# EAGLE schematic amp_soha_v2 (EAGLE 6.4)
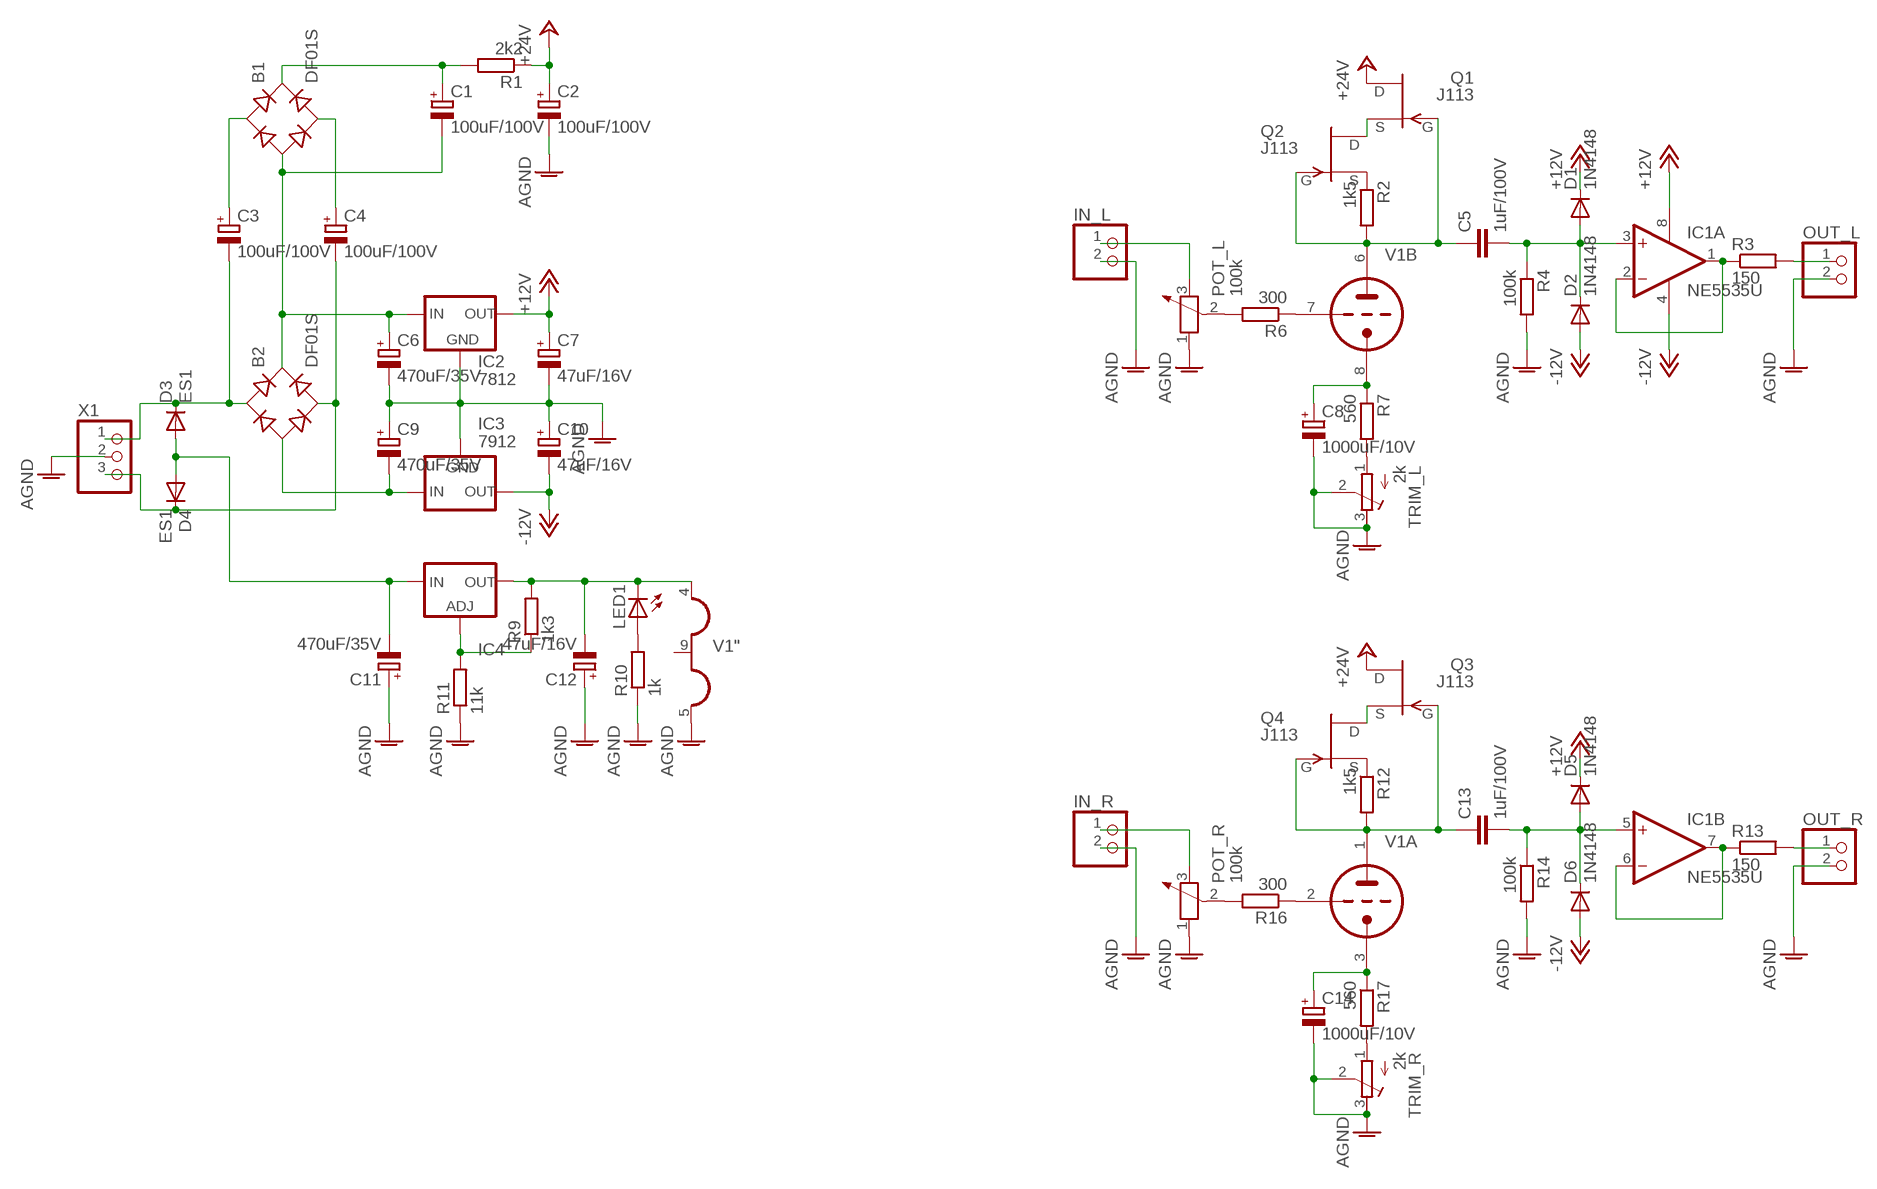
[diagram p0: schematic, sheet 1]

## Parts
B1  DF01S  [DFS]
B2  DF01S  [DFS]
C1  100uF/100V  CPOL-EUE5-10,5  [E5-10,5]
C2  100uF/100V  CPOL-EUE5-10,5  [E5-10,5]
C3  100uF/100V  CPOL-EUE5-10,5  [E5-10,5]
C4  100uF/100V  CPOL-EUE5-10,5  [E5-10,5]
C5  1uF/100V  C-EU075-052X106  [C075-052X106]
C6  470uF/35V  CPOL-EUE5-10,5  [E5-10,5]
C7  47uF/16V  CPOL-EUE2.5-6  [E2,5-6]
C8  1000uF/10V  CPOL-EUE5-10,5  [E5-10,5]
C9  470uF/35V  CPOL-EUE5-10,5  [E5-10,5]
C10  47uF/16V  CPOL-EUE2.5-6  [E2,5-6]
C11  470uF/35V  CPOL-EUE5-10,5  [E5-10,5]
C12  47uF/16V  CPOL-EUE2.5-6  [E2,5-6]
C13  1uF/100V  C-EU075-052X106  [C075-052X106]
C14  1000uF/10V  CPOL-EUE5-10,5  [E5-10,5]
D1  1N4148  [D0805]
D2  1N4148  [D0805]
D3  ES1  [DO-214AC]
D4  ES1  [DO-214AC]
D5  1N4148  [D0805]
D6  1N4148  [D0805]
IC1  NE5535U  [SO08]
IC2  7812  78XXTO-220  [78XXS]
IC3  7912  79XXTO-220  [79XXS]
IC4  LM337TS  [337TS]
IN_L  PINHD-1X2  [1X02]
IN_R  PINHD-1X2  [1X02]
LED1  LED5MM  [LED5MM]
OUT_L  PINHD-1X2  [1X02]
OUT_R  PINHD-1X2  [1X02]
POT_L  100k  POTENTIOMETER_  [1X03]
POT_R  100k  POTENTIOMETER_  [1X03]
Q1  J113  [TO92]
Q2  J113  [TO92]
Q3  J113  [TO92]
Q4  J113  [TO92]
R1  2k2  R-EU_  [R0805]
R2  1k5  R-EU_  [R0805]
R3  150  R-EU_  [R0805]
R4  100k  R-EU_  [R0805]
R6  300  R-EU_  [R0805]
R7  560  R-EU_  [R0805]
R9  1k3  R-EU_  [R0805]
R10  1k  R-EU_  [R0805]
R11  11k  R-EU_  [R0805]
R12  1k5  R-EU_  [R0805]
R13  150  R-EU_  [R0805]
R14  100k  R-EU_  [R0805]
R16  300  R-EU_  [R0805]
R17  560  R-EU_  [R0805]
TRIM_L  2k  RTRIM329W  [RTRIM3296W]
TRIM_R  2k  RTRIM329W  [RTRIM3296W]
V1  12AU7-P  [NOVAL]
X1  W237-103  [W237-103]

## Nets
+12V: C7.+ D1.K(C) D5.K(C) IC1.8(A:V+) IC2.OUT
+24V: C2.+ Q1.3(D) Q3.3(D) R1.1
-12.6V: C12.- IC4.3(OUT) LED1.K(C) R9.2 V1.4(":H1)
-12V: C10.- D2.A D6.A IC1.4(A:V-) IC3.OUT
AGND: C2.- C6.- C7.- C8.- C9.+ C10.+ C11.+ C12.+ C14.- IC2.GND IC3.GND IN_L.2 IN_R.2 OUT_L.2 OUT_R.2 POT_L.1 POT_R.1 R4.2 R10.1 R11.1 R14.2 TRIM_L.2(S) TRIM_L.3(E) TRIM_R.2(S) TRIM_R.3(E) V1.5(":H3) X1.2
N$1: B2.AC1 C3.- D3.C X1.1
N$2: B2.AC2 C4.- D4.C X1.3
N$3: C11.- D3.A D4.A IC4.2(IN)
N$4: IC4.1(ADJ) R9.1 R11.2
N$5: B2.- C9.- IC3.IN
N$6: B1.- B2.+ C1.- C6.+ IC2.IN
N$7: LED1.A R10.2
N$8: B1.AC1 C3.+
N$9: B1.AC2 C4.+
N$10: R16.1 V1.2(A:TG)
N$11: B1.+ C1.+ R1.2
N$12: IN_L.1 POT_L.3
N$13: POT_L.2 R6.2
N$14: R6.1 V1.7(B:TG)
N$15: C8.+ R7.1 V1.8(B:TK)
N$16: Q2.2(S) R2.1
N$17: R7.2 TRIM_L.1(A)
N$18: R17.2 TRIM_R.1(A)
N$19: C5.1 Q1.1(G) Q2.1(G) R2.2 V1.6(B:TA)
N$20: Q1.2(S) Q2.3(D)
N$22: C5.2 D1.A D2.K(C) IC1.3(A:+IN) R4.1
N$24: IC1.1(A:OUT) IC1.2(A:-IN) R3.1
N$25: OUT_L.1 R3.2
N$26: IN_R.1 POT_R.3
N$27: POT_R.2 R16.2
N$29: C14.+ R17.1 V1.3(A:TK)
N$31: C13.1 Q3.1(G) Q4.1(G) R12.2 V1.1(A:TA)
N$32: Q4.2(S) R12.1
N$33: Q3.2(S) Q4.3(D)
N$34: C13.2 D5.A D6.K(C) IC1.5(B:+IN) R14.1
N$35: IC1.6(B:-IN) IC1.7(B:OUT) R13.1
N$36: OUT_R.1 R13.2
Unconnected: V1.9(":H2)

## Library data of the parts
B1 B2 = amp_soha:DF*S: Surface Mount Glass Passivated Bridge Rectifiers Source: Source: Comchip Bridge Rectifiers DF005S-G thru DF10S-G.pdf
C1-C4 C6-C12 C14 = amp_soha:CPOL-EU: POLARIZED CAPACITOR, European symbol
C5 C13 = amp_soha:C-EU: CAPACITOR, European symbol
D1 D2 D5 D6 = amp_soha:1N4148: DIODE general purpose rectifier, 1 A
D3 D4 = amp_soha:ES1
IC1 = amp_soha:NE5535: Dual Operational Amplifier Low Power, Single-Supply, Rail-To-Rail Operational Amplifier Source: http://focus.ti.com/lit/ds/symlink/opa2345.pdf http://focus.ti.com .. opa241.pdf http://focus.ti.com/lit/ds/symlink/opa2134.pdf
IC2 = amp_soha:78XX: VOLTAGE REGULATOR
IC3 = amp_soha:79XX: VOLTAGE REGULATOR
IC4 = amp_soha:LM337TS: VOLTAGE REGULATOR
IN_L IN_R OUT_L OUT_R = amp_soha:PINHD-1X2: PIN HEADER
LED1 = amp_soha:LED
POT_L POT_R = amp_soha:POTENTIOMETER_: Potentiometer
Q1-Q4 = amp_soha:J113: N-Channel Junction FET
R1-R4 R6 R7 R9-R14 R16 R17 = amp_soha:R-EU_: RESISTOR, European symbol
TRIM_L TRIM_R = amp_soha:RTRIM329: Trimm resistor
V1 = amp_soha:12AU7-P
X1 = amp_soha:W237-103: WAGO SCREW CLAMP